# EAGLE design untitled (EAGLE 5.10)
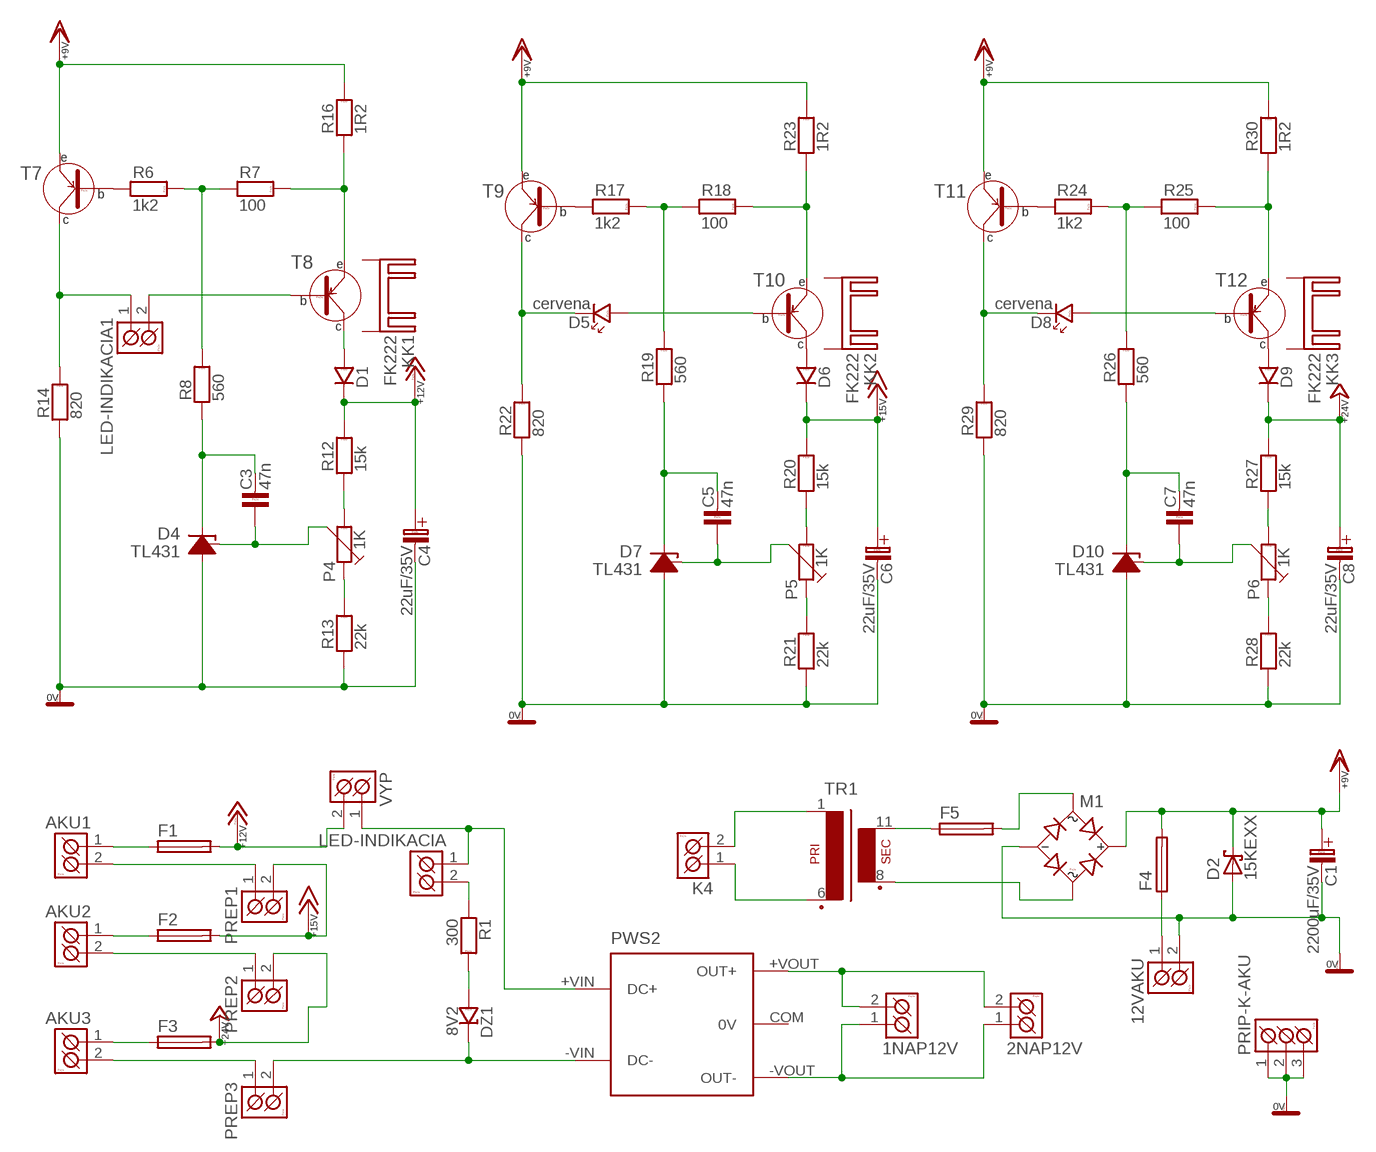
[diagram p0: schematic, sheet 1]

## Parts
1NAP12V  ARK550/2  [ARK550/2]
2NAP12V  ARK550/2  [ARK550/2]
12VAKU  ARK550/2  [ARK550/2]
AKU1  ARK550/2  [ARK550/2]
AKU2  ARK550/2  [ARK550/2]
AKU3  ARK550/2  [ARK550/2]
C1  2200uF/35V  C-EL_7,5+  [C-EL7,5+]
C3  47n  C-5  [C-5]
C4  22uF/35V  C-EL_3,5  [C-EL_3,5]
C5  47n  C-5  [C-5]
C6  22uF/35V  C-EL_3,5  [C-EL_3,5]
C7  47n  C-5  [C-5]
C8  22uF/35V  C-EL_3,5  [C-EL_3,5]
D1  BA159  [D-10]
D2  15KEXX  [CB429-17]
D4  TL431  [TO92D-]
D5  cervena  LED_2,5X5  [LED2,5X5]
D6  BA159  [D-10]
D7  TL431  [TO92D-]
D8  cervena  LED_2,5X5  [LED2,5X5]
D9  BA159  [D-10]
D10  TL431  [TO92D-]
DZ1  8V2  BZX85V  [D-7,5]
F1  SH22,5A  [SH22,5A]
F2  SH22,5A  [SH22,5A]
F3  SH22,5A  [SH22,5A]
F4  SH22,5A  [SH22,5A]
F5  SH22,5A  [SH22,5A]
K4  ARK500/2  [ARK500/2]
KK1  FK222  [FK222]
KK2  FK222  [FK222]
KK3  FK222  [FK222]
LED-INDIKACIA  ARK550/2  [ARK550/2]
LED-INDIKACIA1  ARK550/2  [ARK550/2]
M1  B250C1500  [DM_WOM]
P4  1K  PT-6H_STO  [PT6H]
P5  1K  PT-6H_STO  [PT6H]
P6  1K  PT-6H_STO  [PT6H]
PREP1  ARK550/2  [ARK550/2]
PREP2  ARK550/2  [ARK550/2]
PREP3  ARK550/2  [ARK550/2]
PRIP-K-AKU  ARK550/3  [ARK550/3]
PWS2  TAP2422  [TAP2422]
R1  300  R-5  [R-5]
R6  1k2  R-5  [R-5]
R7  100  R-5  [R-5]
R8  560  R-5  [R-5]
R12  15k  R-5  [R-5]
R13  22k  R-5  [R-5]
R14  820  R-5  [R-5]
R16  1R2  R-5  [R-5]
R17  1k2  R-5  [R-5]
R18  100  R-5  [R-5]
R19  560  R-5  [R-5]
R20  15k  R-5  [R-5]
R21  22k  R-5  [R-5]
R22  820  R-5  [R-5]
R23  1R2  R-5  [R-5]
R24  1k2  R-5  [R-5]
R25  100  R-5  [R-5]
R26  560  R-5  [R-5]
R27  15k  R-5  [R-5]
R28  22k  R-5  [R-5]
R29  820  R-10  [R-10]
R30  1R2  R-5  [R-5]
T7  BC556  [TO-92]
T8  BD140  [TO-126S]
T9  BC556  [TO-92]
T10  BD140  [TO-126S]
T11  BC556  [TO-92]
T12  BD140  [TO-126S]
TR1  EI48-1  [EI48-1]
VYP  ARK550/2  [ARK550/2]

## Nets
0V: 12VAKU.2(K2) C1.C-(C_EL-) C4.C-(C_EL-) C6.C-(C_EL-) C8.C-(C_EL-) D2.A D4.2(A) D7.2(A) D10.2(A) M1.- PRIP-K-AKU.1(K1) PRIP-K-AKU.2(K2) PRIP-K-AKU.3(K3) R13.1 R14.1 R21.1 R22.1 R28.1 R29.1
+9V: C1.C+(C_EL+) D2.C F4.2 M1.+ R16.2 R23.2 R30.2 T7.3(E) T9.3(E) T11.3(E)
+12V: C4.C+(C_EL+) D1.K F1.2 R12.2 VYP.2(K2)
+15V: C6.C+(C_EL+) D6.K F2.2 PREP1.2(K2) R20.2
+24V: C8.C+(C_EL+) D9.K F3.2 PREP2.2(K2) R27.2
N$1: LED-INDIKACIA.2(K2) R1.1
N$2: DZ1.A R1.2
N$3: K4.2(K2) TR1.1
N$4: D1.A T8.2(C)
N$5: F5.1 TR1.11(S4)
N$6: F5.2 M1.AC1
N$7: LED-INDIKACIA.1(K1) PWS2.+VIN(DC+) VYP.1(K1)
N$8: AKU1.1(K1) F1.1
N$9: 12VAKU.1(K1) F4.1
N$10: AKU1.2(K2) PREP1.1(K1)
N$15: M1.AC2 TR1.8(S3)
N$17: AKU2.1(K1) F2.1
N$18: AKU3.2(K2) PREP3.1(K1)
N$19: AKU3.1(K1) F3.1
N$23: K4.1(K1) TR1.6(P2)
N$28: R6.1 T7.2(B)
N$30: R6.2 R7.1 R8.2
N$31: R7.2 R16.1 T8.1(E)
N$33: C3.2 D4.3(K) R8.1
N$34: LED-INDIKACIA1.2(K2) T8.3(B)
N$35: LED-INDIKACIA1.1(K1) R14.2 T7.1(C)
N$37: C3.1 D4.1(J) P4.3
N$38: 1NAP12V.2(K2) 2NAP12V.2(K2) PWS2.+VOUT(OUT+)
N$39: P4.1 R13.2
N$40: P4.2 R12.1
N$42: R17.1 T9.2(B)
N$43: D6.A T10.2(C)
N$44: DZ1.K PREP3.2(K2) PWS2.-VIN(DC-)
N$45: 1NAP12V.1(K1) 2NAP12V.1(K1) PWS2.-VOUT(OUT-)
N$46: R17.2 R18.1 R19.2
N$47: R18.2 R23.1 T10.1(E)
N$49: C5.2 D7.3(K) R19.1
N$50: D5.A T10.3(B)
N$51: D5.K R22.2 T9.1(C)
N$52: C5.1 D7.1(J) P5.3
N$53: P5.1 R21.2
N$54: P5.2 R20.1
N$55: R24.1 T11.2(B)
N$56: D9.A T12.2(C)
N$57: R24.2 R25.1 R26.2
N$58: R25.2 R30.1 T12.1(E)
N$60: C7.2 D10.3(K) R26.1
N$61: D8.A T12.3(B)
N$62: D8.K R29.2 T11.1(C)
N$63: C7.1 D10.1(J) P6.3
N$64: P6.1 R28.2
N$65: P6.2 R27.1
N$66: AKU2.2(K2) PREP2.1(K1)
Unconnected: KK1.A2,8(K) KK1.B2,8(K) KK2.A2,8(K) KK2.B2,8(K) KK3.A2,8(K) KK3.B2,8(K) PWS2.COM(0V)

## Library data of the parts
1NAP12V 2NAP12V 12VAKU AKU1-AKU3 LED-INDIKACIA LED-INDIKACIA1 PREP1-PREP3 VYP = #PaJa_92:ARK550/2
C1 = #PaJa_92:C-EL_7,5+
C3 C5 C7 = #PaJa_92:C-5
C4 C6 C8 = #PaJa_92:C-EL_3,5
D1 D6 D9 = #PaJa_92:BA159
D2 = diode:15KEXX: DIODE
D4 D7 D10 = ads4:TL431: TL431 Adjustable Shunt Regulator
D5 D8 = #PaJa_92:LED_2,5X5
DZ1 = #PaJa_92:BZX85V???
F1-F5 = fuse:SH22,5A: FUSE HOLDER grid 22,5mm, isolated cap OGN0031 8201, Schurter (Buerklin)
K4 = #PaJa_92:ARK500/2
KK1-KK3 = #heatsink:FK222: HEATSINK manufacturer Fischer/distributor Buerklin
M1 = #PaJa_92:B250C1500
P4-P6 = #PaJa_92:PT-6H_STO
PRIP-K-AKU = #PaJa_92:ARK550/3
PWS2 = traco-electronic:TAP2422: Abgekündigt Ersetzt durch TEN 15 Serie,
R1 R6-R8 R12-R14 R16-R28 R30 = #PaJa_92:R-5
R29 = #PaJa_92:R-10
T7 T9 T11 = #PaJa_92:BC556
T8 T10 T12 = #PaJa_92:BD140
TR1 = trafo:EI48-1: TRANSFORMER 1 primary winding, 1 secondary winding ERA

## Board
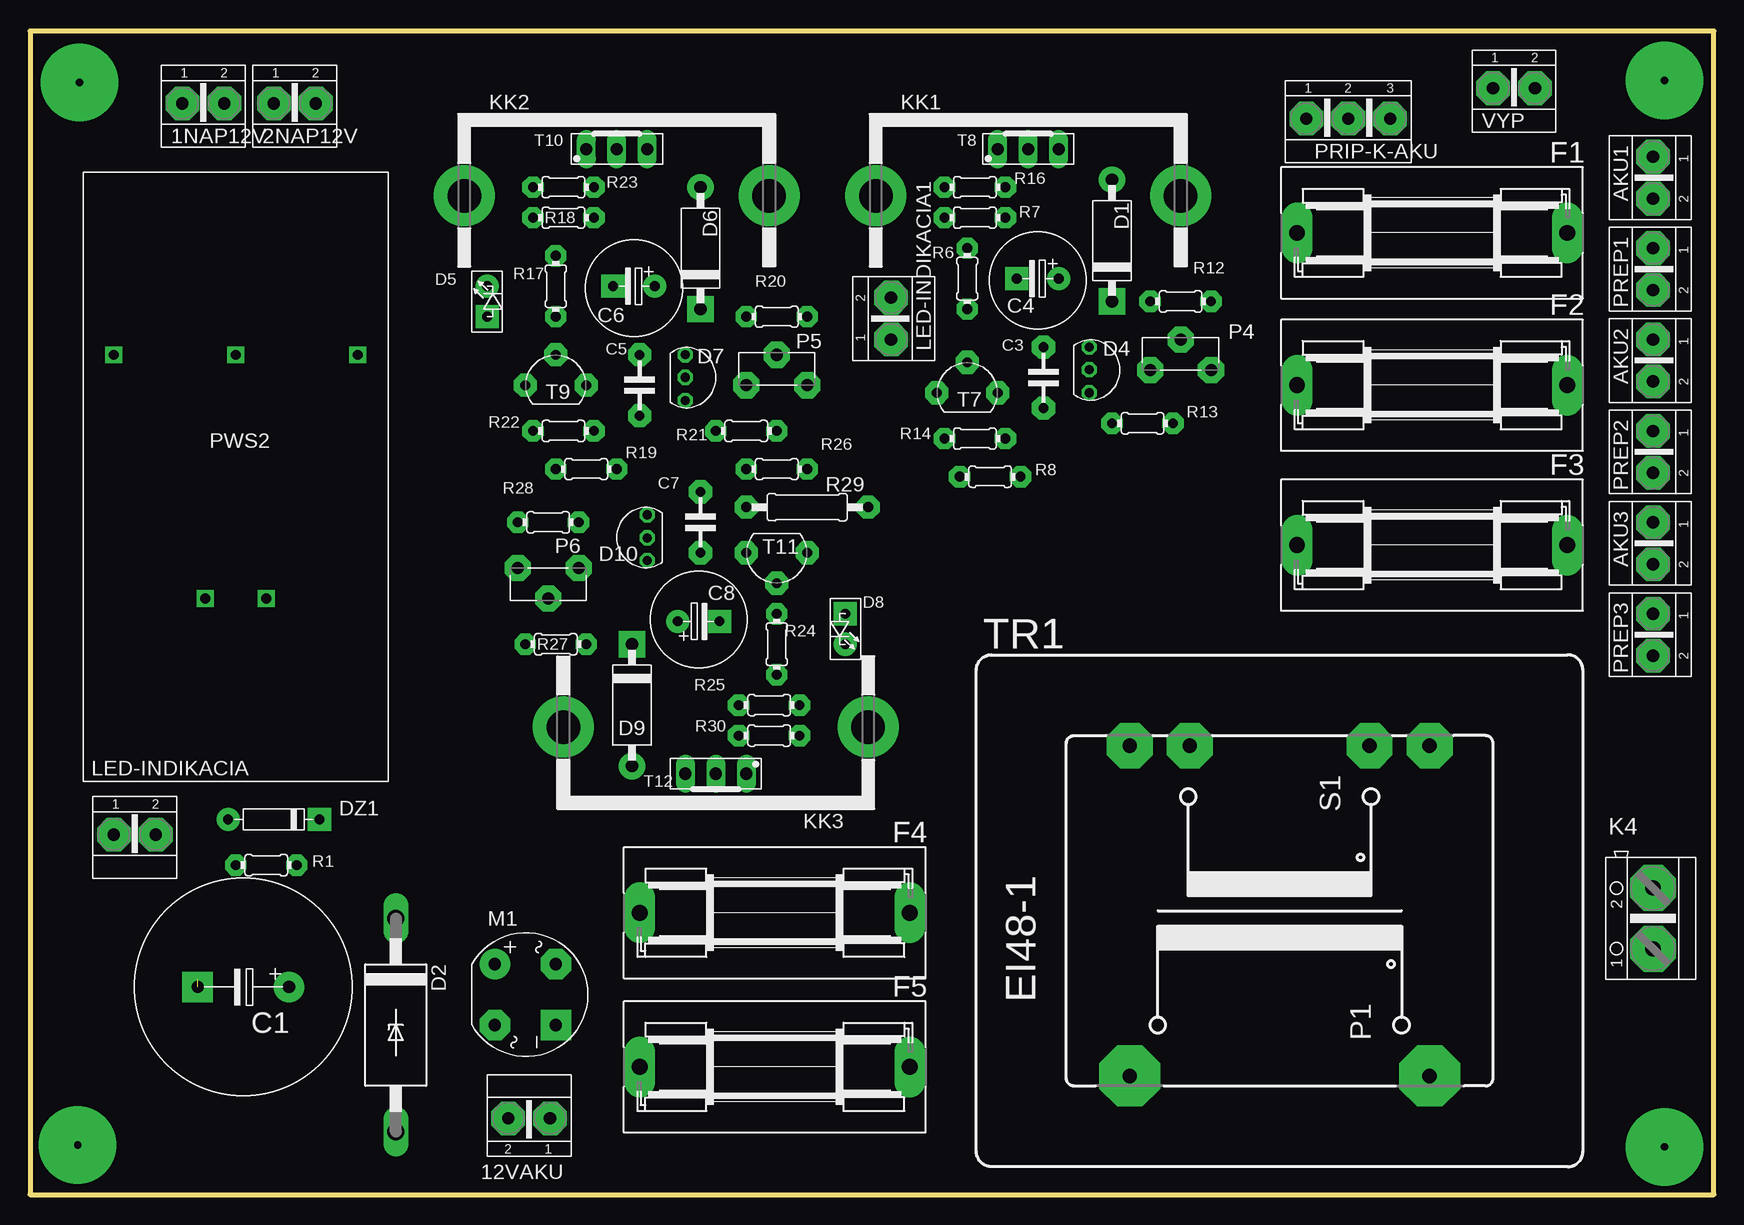
[diagram p1: board, top side]
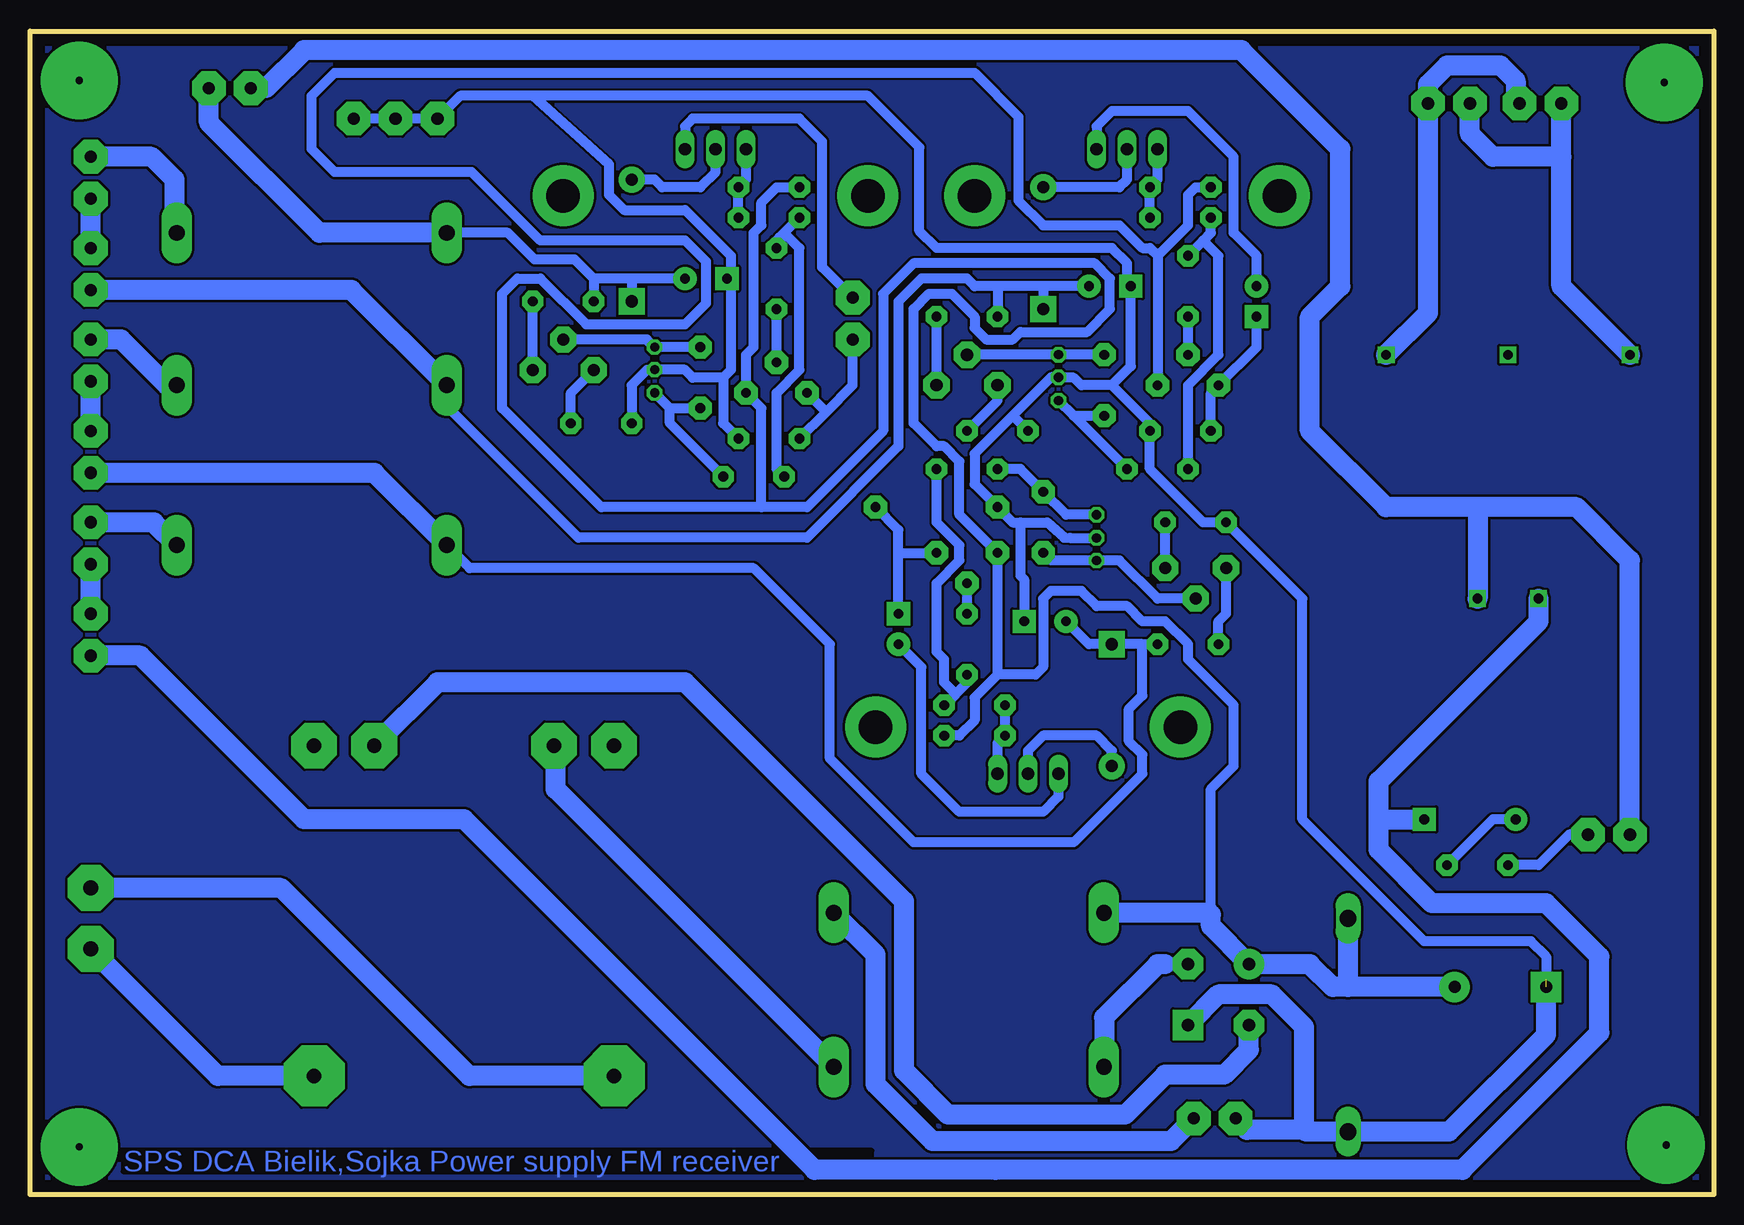
[diagram p2: board, bottom side, seen from below]

Size 140.31 x 96.98 mm. Coordinates in mm from the lower left corner, seen from the top.
Outline: 0,0 140.31,0 140.31,96.98 0,96.98 0,0
Copper layers (1*16): Top 0.035mm / dielectric 1.5mm / Bottom 0.035mm
Design rules "default": minimum track width 10mil, minimum drill 24mil, track to track 8mil, track to pad 8mil, pad to pad 8mil, via to via 8mil, smd to smd 8mil, copper to edge 40mil, drill to drill 8mil, minimum pad ring 10mil, minimum via ring 8mil, stop-mask expansion 4mil, vias tented up to drill 0mil, thermal gap 10mil

### Footprints (pad centres in the part's own frame; a part is rotated, then mirrored left to right if it is on the bottom)
ARK550/2 = drill 1.016 pad 2.8 octagon: 1 0,0; 2 3.493,0
C-EL7,5+ = drill 1.016 pad 2.54 round: C+ -3.81,0 | drill 1.016 pad 2.54 square: C- 3.81,0
C-5 = drill 0.813 pad 1.93 octagon: 1 -2.54,0; 2 2.54,0
C-EL_3,5 = drill 0.813 pad 1.93 round: C+ 0,0 | drill 0.813 pad 1.93 square: C- 3.493,0
D-10 = drill 1.016 pad 2.184 round: A -5.08,0 | drill 1.016 pad 2.184 square: K 5.08,0
CB429-17 = drill 1.397 long: A 8.89,0; C -8.89,0
TO92D- = drill 0.762 octagon: 1 -1.905,0; 2 -0.025,0; 3 1.905,0
LED2,5X5 = drill 0.813 pad 1.93 round: A 2.54,0 | drill 0.813 pad 1.93 square: K 0,0
D-7,5 = drill 0.813 pad 1.93 round: A -3.81,0 | drill 0.813 pad 1.93 square: K 3.81,0
SH22,5A = drill 1.321 pad 2.54 long: 1 -11.252,0; 2 11.252,0
ARK500/2 = drill 1.27 pad 3.81 octagon: 1 -2.54,0; 2 2.54,0
FK222 = drill 2.794 pad 5.08 round: A2,8 5.791,-12.7; B2,8 5.791,12.7
DM_WOM = drill 1.016 pad 2.54 round: + -2.54,-2.54 | drill 1.016 pad 2.54 square: - 2.54,2.54 | drill 1.016 pad 2.54 octagon: AC1 -2.54,2.54; AC2 2.54,-2.54
PT6H = drill 1.016 pad 2.184 octagon: 1 -2.54,-1.27; 2 2.54,-1.27; 3 0,1.27
ARK550/3 = drill 1.016 pad 2.8 octagon: 1 -3.493,0; 2 0,0; 3 3.493,0
TAP2422 = drill 0.813 pad 1.397 square: +VIN 2.54,-10.16; +VOUT 10.16,10.16; -VIN -2.54,-10.16; -VOUT -10.16,10.16; COM 0,10.16
R-5 = drill 0.813 pad 1.778 octagon: 1 -2.54,0; 2 2.54,0
R-10 = drill 0.813 pad 1.93 octagon: 1 -5.08,0; 2 5.08,0
TO-92 = drill 0.813 pad 1.93 octagon: 1 0,2.54; 2 2.54,0; 3 0,-2.54
TO-126S = drill 1.016 pad 1.6 long: 1 -2.54,0; 2 0,0; 3 2.54,0
EI48-1 = drill 1.194 pad 5.08 octagon: 1 -13.767,12.497; 6 -13.767,-12.497 | drill 1.194 pad 3.81 octagon: 7 13.767,-12.497; 8 13.767,-7.493; 11 13.767,7.493; 12 13.767,12.497

### Placement (x,y rotation side)
1NAP12V  12.7,90.96 0 top
2NAP12V  20.32,90.96 0 top
12VAKU  43.34,6.35 180 top
AKU1  135.25,86.52 270 top
AKU2  135.25,71.28 270 top
AKU3  135.25,56.04 270 top
C1  17.78,17.3 180 top
C3  84.45,68.1 270 top
C4  85.72,76.36 180 top
C5  50.8,67.47 270 top
C6  52.07,75.72 180 top
C7  55.88,56.04 90 top
C8  53.98,47.78 0 top
D1  90.17,79.53 270 top
D2  30.48,14.13 270 top
D4  88.27,68.74 270 top
D5  38.1,73.18 90 top
D6  55.88,78.9 270 top
D7  54.61,68.1 270 top
D8  67.94,48.42 270 top
D9  50.16,40.8 90 top
D10  51.44,54.77 90 top
DZ1  20.32,31.27 0 top
F1  116.84,80.17 180 top
F2  116.84,67.47 180 top
F3  116.84,54.13 180 top
F4  62.07,23.5 180 top
F5  62.07,10.64 180 top
K4  135.25,23.02 90 top
KK1  83.19,89.06 270 top
KK2  48.9,89.06 270 top
KK3  57.15,33.18 90 top
LED-INDIKACIA  6.99,30 0 top
LED-INDIKACIA1  71.75,71.28 90 top
M1  41.27,16.67 270 top
P4  95.89,70.01 0 top
P5  62.23,68.74 0 top
P6  43.18,50.96 180 top
PREP1  135.25,78.9 270 top
PREP2  135.25,63.66 270 top
PREP3  135.25,48.42 270 top
PRIP-K-AKU  109.86,89.69 0 top
PWS2  17.14,59.85 0 top
R1  19.68,27.46 0 top
R6  78.11,76.36 90 top
R7  78.74,81.44 0 top
R8  80.01,59.85 180 top
R12  95.89,74.45 180 top
R13  92.71,64.29 0 top
R14  78.74,63.02 180 top
R16  78.74,83.98 180 top
R17  43.81,75.72 90 top
R18  44.45,81.44 0 top
R19  46.35,60.48 180 top
R20  62.23,73.18 180 top
R21  59.69,63.66 0 top
R22  44.45,63.66 180 top
R23  44.45,83.98 180 top
R24  62.23,45.88 270 top
R25  61.59,40.8 180 top
R26  62.23,60.48 0 top
R27  43.81,45.88 0 top
R28  43.18,56.04 0 top
R29  64.77,57.31 0 top
R30  61.59,38.26 0 top
T7  78.11,66.83 90 top
T8  83.19,87.15 0 top
T9  43.81,67.47 90 top
T10  48.9,87.15 0 top
T11  62.23,53.5 270 top
T12  57.15,35.08 180 top
TR1  104.14,23.65 90 top
VYP  121.92,92.23 0 top

### Tracks (layer width: path | path; a pad name or v marks a point on that pad's centre or on a via)
0V  (1 unrouted)
  Bottom 0.813: 82.55,68.1 85.09,68.1 85.75,68.76 D4.2 88.29,68.74 88.9,68.74 90.17,67.47 R13.1 | 82.55,68.1 81.92,68.74 81.92,76.04 C4.C- 81.92,76.68 81.92,78.26 85.72,82.07 90.81,82.07 92.08,83.34 92.08,85.88 98.42,91.6 | 82.55,68.1 82.55,64.29 R14.1 | 50.16,67.47 46.99,64.29 R22.1 46.99,60.48 42.55,56.04 R28.1 34.29,49.69 34.29,31.27 24.13,21.11 15.24,21.11 13.97,19.84 13.97,17.94 | 50.16,67.47 52.7,67.47 53.34,68.1 54.59,68.1 D7.2 55.22,68.13 58.42,64.93 | 50.16,67.47 48.58,69.06 C6.C- 48.9,76.04 48.9,77.63 50.16,78.9 64.77,78.9 66.2,80.33 66.2,87.31 70.48,91.6 98.42,91.6 | D10.2 53.63,54.74 54.13,54.77 | 54.13,54.77 | 54.13,54.77 55.56,56.04 57.78,56.04 | 57.78,56.04 58.42,56.04 R29.1 61.59,59.21 61.59,61.75 58.42,64.93 | C8.C- 57.47,51.28 57.78,51.59 57.78,56.04 | PRIP-K-AKU.3 PRIP-K-AKU.2 PRIP-K-AKU.1 104.46,91.6 98.42,91.6 | 58.42,64.93 R21.1 | 33.97,5.24 34.13,5.4
  Bottom 1.676: C1.C- 13.97,13.34 22.07,5.24 D2.A 33.97,5.24 | M1.- 41.27,16.67 36.83,16.67 34.13,13.97 34.13,5.4 38.89,5.4 12VAKU.2
+9V
  Bottom 0.813: R16.2 78.11,83.98 79.38,82.71 79.38,80.8 80.01,80.17 80.01,70.64 80.64,70.01 T7.3 79.38,65.56 79.38,57.31 | R23.2 43.18,83.98 43.81,83.34 43.81,80.8 46.35,78.26 | R30.2 62.87,38.26 61.59,39.53 61.59,41.43 59.69,43.34 | 59.69,43.34 T11.3 62.87,56.67 62.87,61.12 64.14,62.39 64.77,62.39 66.67,64.29 66.67,73.82 65.41,75.09 63.5,75.09 61.59,73.18 61.59,72.23 60.64,71.28 58.42,71.28 57.78,71.91 52.23,71.91 50.32,73.82 50.32,76.36 51.59,77.63 66.67,77.63 69.22,75.09 69.22,63.66 75.56,57.31 79.38,57.31 | 41.91,23.34 41.91,33.81 40.01,35.72 40.01,40.8 43.81,44.61 43.81,45.88 45.72,47.78 47.62,47.78 48.9,49.05 51.44,49.05 52.7,50.32 55.24,50.32 55.88,49.69 55.88,43.97 56.52,43.34 59.69,43.34 | 46.35,78.26 T9.3 | 46.35,78.26 46.99,78.9 47.62,78.9 49.53,80.8 55.88,80.8 57.94,82.87 57.94,89.85 61.59,93.5 114.94,93.5 116.84,91.6 116.84,87.15 114.94,85.25 103.5,85.25 97.79,79.53 85.72,79.53 83.98,77.79 83.98,74.3 85.72,72.55 93.98,72.55 97.79,76.36 99.69,76.36 100.97,75.09 100.97,65.56 92.71,57.31 79.38,57.31
  Bottom 1.676: C1.C+ 30.48,17.3 | 30.48,17.3 D2.C | 30.48,17.3 31.75,17.3 33.66,19.21 M1.+ 41.91,22.38 41.91,23.34 42.07,23.5 F4.2
+12V
  Bottom 0.813: C4.C+ 90.17,76.36 | 90.17,76.36 D1.K | F1.2 100.49,80.17 98.27,77.95 94.93,77.95 93.34,76.36 | 90.17,76.36 93.34,76.36 | 93.34,76.36 R12.2
  Bottom 1.676: F1.2 116.2,80.17 125.41,89.38 VYP.2
+15V
  Bottom 0.813: F2.2 105.59,65.74 94.61,54.77 75.56,54.77 67.94,62.39 67.94,74.45 66.04,76.36 62.23,76.36 61.59,75.72 59.69,75.72 | C6.C+ 55.88,75.72 | 55.88,75.72 59.69,75.72 | 59.69,75.72 R20.2 | 55.88,75.72 D6.K
  Bottom 1.676: PREP1.2 113.53,75.41 F2.2
+24V
  Bottom 0.813: 47.62,45.88 R27.2 | 47.62,45.88 D9.K 52.07,45.88 C8.C+ | F3.2 103.68,52.23 80.01,52.23 73.66,45.88 73.66,36.35 66.67,29.37 53.34,29.37 47.62,35.08 47.62,36.67 48.74,37.78 48.74,40.48 47.62,41.59 47.62,45.88
  Bottom 1.676: PREP2.2 111.62,60.17 F3.2
GND
  pour Bottom: 0,0 140.34,0 140.34,97 0,97
N$1
  Bottom 0.813: LED-INDIKACIA.2 12.06,30 14.61,27.46 R1.1
N$2
  Bottom 0.813: DZ1.A 18.41,31.27 R1.2
N$3
  Bottom 1.676: TR1.1 103.71,9.89 119.38,25.56 K4.2
N$4
  Bottom 0.813: T8.2 83.19,85.25 84.45,83.98 87.63,83.98 88.27,84.61 D1.A
N$5
  Bottom 1.676: F5.1 73.34,10.64 96.52,33.81 96.52,37.29 TR1.11
N$6
  Bottom 0.813: M1.AC1 45.72,19.21
  Bottom 1.676: 45.72,19.21 46.35,19.21 50.8,14.76 50.8,10.65 F5.2
N$7
  Bottom 1.676: VYP.1 120.65,92.23 117.47,95.41 39.37,95.41 31.11,87.15 31.11,75.72 33.66,73.18 33.66,63.66 27.3,57.31 19.68,57.31 | LED-INDIKACIA.1 6.99,52.86 11.43,57.31 19.68,57.31 | 19.68,57.31 PWS2.+VIN
N$8
  Bottom 0.813: F1.1 128.27,80.35
  Bottom 1.676: AKU1.1 130.18,86.52 128.27,84.61 128.27,80.35
N$9
  Bottom 1.676: 12VAKU.1 | 12VAKU.1 45.24,4.45 65.09,4.45 69.85,9.21 69.85,20.02 F4.1
N$10
  Bottom 1.676: PREP1.1 AKU1.2
N$12  (via drill 0.6 pad 6.45)
  other vias: 3.97,4.13
N$13  (via drill 0.6 pad 6.45)
  other vias: 4.13,92.71
N$14  (via drill 0.6 pad 6.45)
  other vias: 136.21,3.97
N$15
  Bottom 1.676: TR1.8 106.35,42.7 85.72,42.7 67.47,24.45 67.47,10.32 63.82,6.67 49.05,6.67 45.72,10 40.8,10 38.73,12.06 M1.AC2
N$17
  Bottom 1.676: F2.1 128.91,67.47 132.72,71.28 AKU2.1
N$18
  Bottom 1.676: PREP3.1 AKU3.2
N$19
  Bottom 1.676: AKU3.1 130,56.04 F3.1
N$23
  Bottom 1.676: TR1.6 124.66,9.89 K4.1
N$28
  Bottom 0.813: T7.2 R6.1
N$30
  Bottom 0.813: 77.79,79.85 R7.1 | 77.79,79.85 78.11,79.53 R6.2 | 77.79,79.85 77.15,79.85 76.2,78.9 76.2,68.74 78.11,66.83 78.11,60.48 R8.2
N$31
  Bottom 0.813: T8.1 80.64,84.61 R16.1 R7.2
N$33
  Bottom 0.813: 87,65.56 C3.2 | 87,65.56 D4.3 | R8.1 87,64.29 87,65.56
N$34
  Bottom 0.813: LED-INDIKACIA1.2 74.3,77.31 74.3,87.79 76.2,89.69 85.09,89.69 85.72,89.06 T8.3
N$35
  Bottom 0.813: LED-INDIKACIA1.1 71.75,67.47 73.98,65.25 | R14.2 73.98,65.25 | 73.98,65.25 T7.1
N$37
  Bottom 0.813: C3.1 D4.1 88.9,71.28 P4.3
N$38
  Bottom 0.813: 16.51,91.28 1NAP12V.2
  Bottom 1.676: PWS2.+VOUT 23.81,73.5 2NAP12V.2 23.81,92.55 22.23,94.14 17.78,94.14 16.51,92.87 16.51,91.28
N$39
  Bottom 0.813: P4.1 95.25,66.83 R13.2
N$40
  Bottom 0.813: P4.2 R12.1
N$42
  Bottom 0.813: T9.2 R17.1
N$43
  Bottom 0.813: T10.2 48.9,84.61 49.53,83.98 D6.A
N$44
  Bottom 1.676: PREP3.2 131.13,44.93 117.47,31.27 104.14,31.27 74.93,2.06 59.85,2.06 20.95,2.06 9.53,13.49 9.53,19.84 13.97,24.29 23.5,24.29 27.94,28.73 27.94,31.27 | PWS2.-VIN 14.61,47.78 27.94,34.45 27.94,31.27 | 27.94,31.27 DZ1.K
N$45
  Bottom 1.676: PWS2.-VOUT 12.7,75.72 12.7,86.52 | 12.7,86.52 1NAP12V.1 | 2NAP12V.1 20.32,88.42 18.41,86.52 12.7,86.52
N$46
  Bottom 0.813: R18.1 41.91,80.17 42.55,79.53 | 42.55,79.53 R17.2 | R19.2 43.81,67.47 41.27,70.01 41.27,78.26 42.55,79.53
N$47
  Bottom 0.813: R18.2 R23.1 46.35,84.61 T10.1
N$49
  Bottom 0.813: 53.34,64.93 D7.3 | 53.34,64.93 C5.2 | R19.1 53.34,64.93
N$50
  Bottom 0.813: D5.A 38.1,78.26 40.01,80.17 40.01,86.52 43.81,90.33 50.16,90.33 51.44,89.06 T10.3
N$51
  Bottom 0.813: D5.K 38.1,70.64 T9.1 41.91,66.83 R22.2
N$52
  Bottom 0.813: C5.1 D7.1 P5.3
N$53
  Bottom 0.813: P5.1 59.69,66.2 R21.2
N$54
  Bottom 0.813: P5.2 R20.1
N$55
  Bottom 0.813: R24.1 T11.2
N$56
  Bottom 0.813: D9.A 50.16,36.99 51.44,38.26 55.88,38.26 57.15,36.99 T12.2
N$57
  Bottom 0.813: R24.2 62.23,42.7 63.18,41.75 | 63.18,41.75 R25.1 | 63.18,41.75 64.14,42.7 64.14,44.61 64.77,45.24 64.77,50.96 62.87,52.86 62.87,54.13 64.77,56.04 R26.2
N$58
  Bottom 0.813: T12.1 59.69,37.62 R30.1 R25.2
N$60
  Bottom 0.813: D10.3 53.98,56.67 C7.2 57.78,60.48 R26.1
N$61
  Bottom 0.813: T12.3 54.61,33.18 55.88,31.91 62.87,31.91 66.04,35.08 66.04,43.97 D8.A
N$62
  Bottom 0.813: D8.K 67.94,53.5 | 67.94,53.5 67.94,55.4 R29.2 | 67.94,53.5 T11.1
N$63
  Bottom 0.813: P6.3 46.35,49.69 49.53,52.86 D10.1 55.24,52.86 C7.1
N$64
  Bottom 0.813: P6.1 R28.2
N$65
  Bottom 0.813: P6.2 40.64,48.42 41.27,47.78 R27.1
N$66
  Bottom 1.676: PREP2.1 AKU2.2
N$1112  (via drill 0.6 pad 6.45)
  other vias: 136.21,92.87

### Text on the board
Bottom: SPS DCA Bielik,Sojka Power supply FM receiver